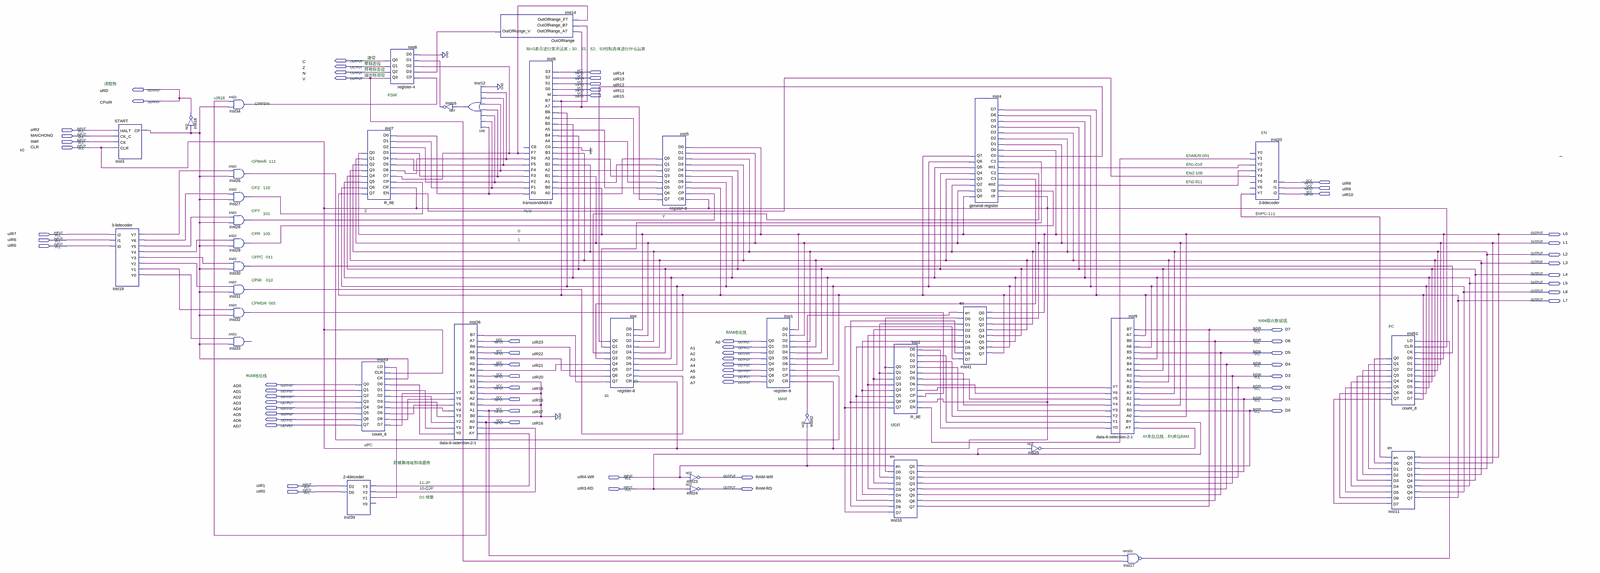
[diagram p0: schematic sheet, whole]
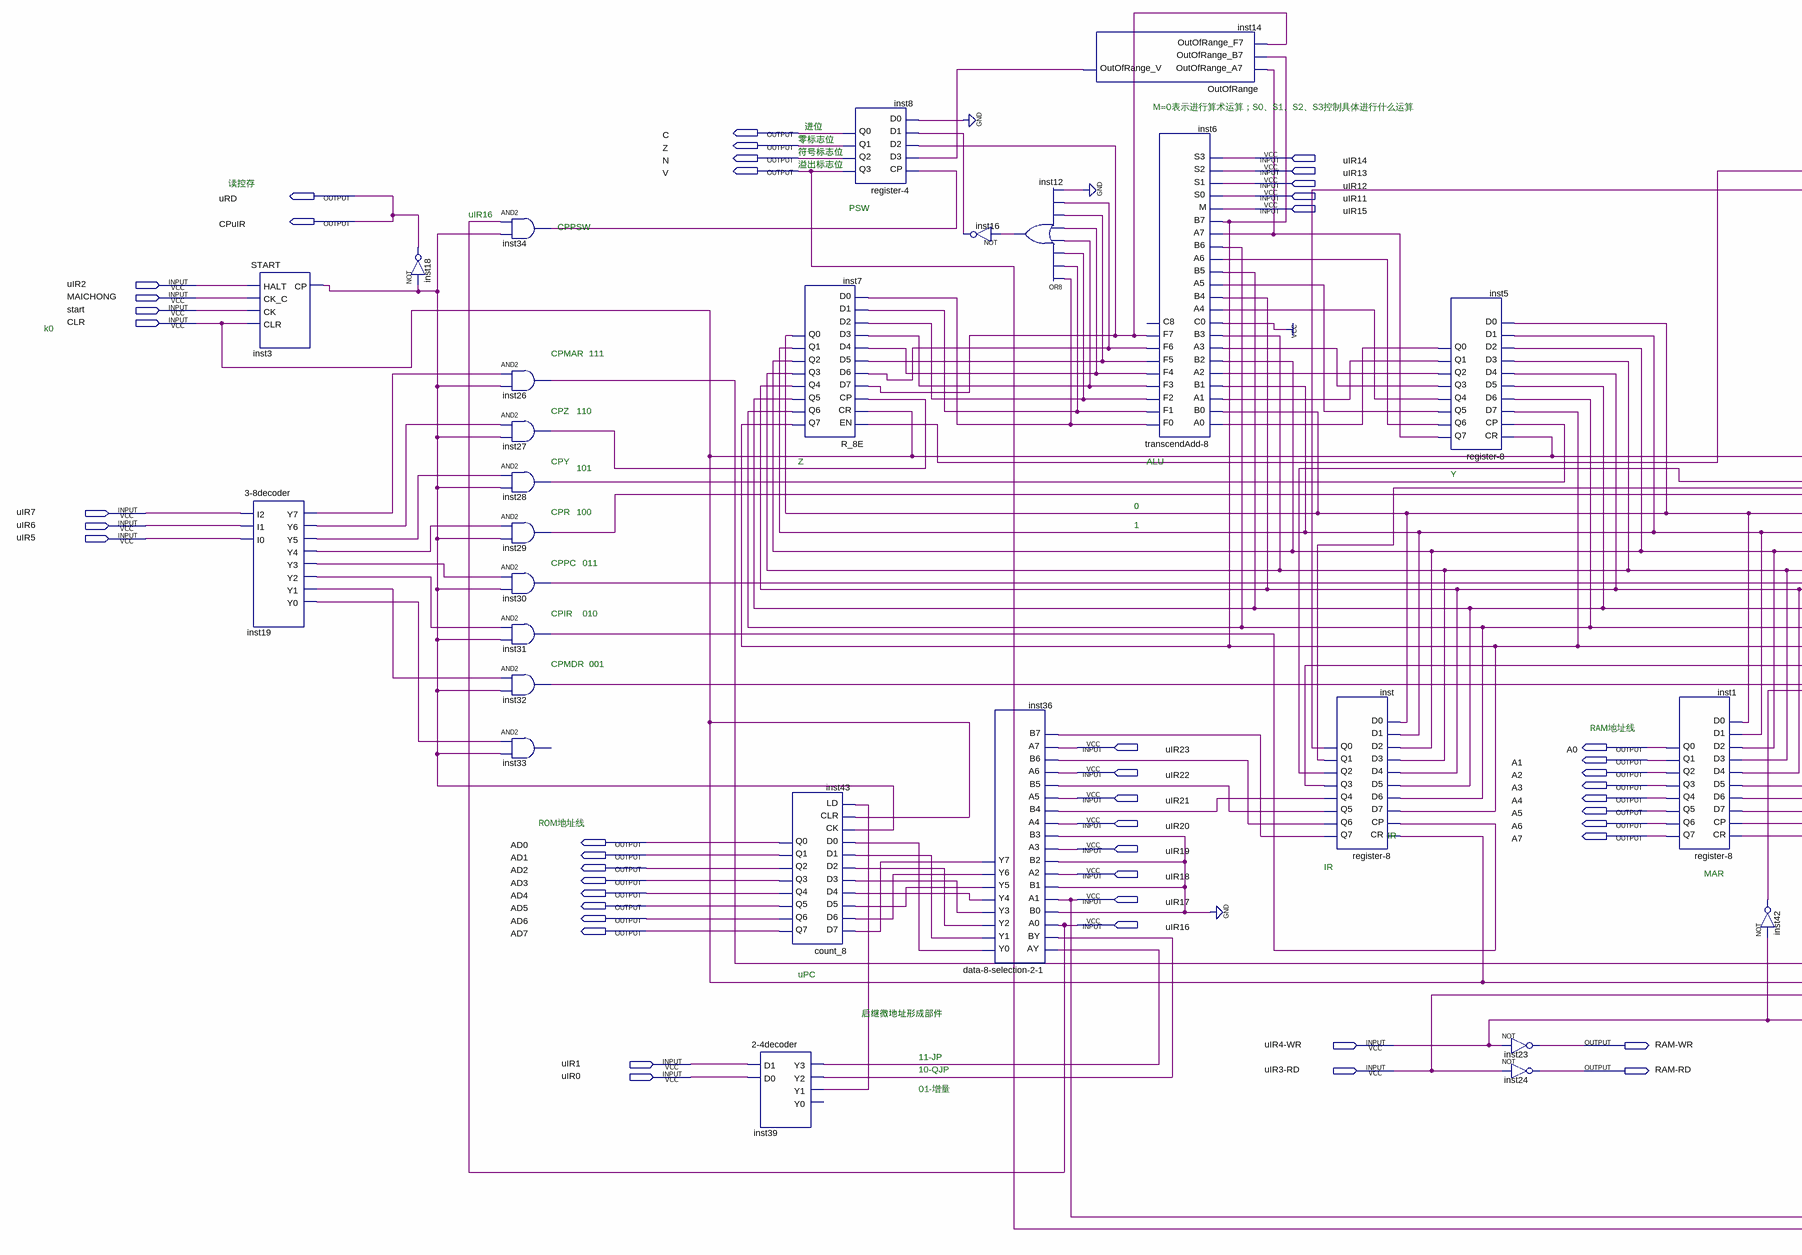
[diagram p1: schematic sheet, left part]
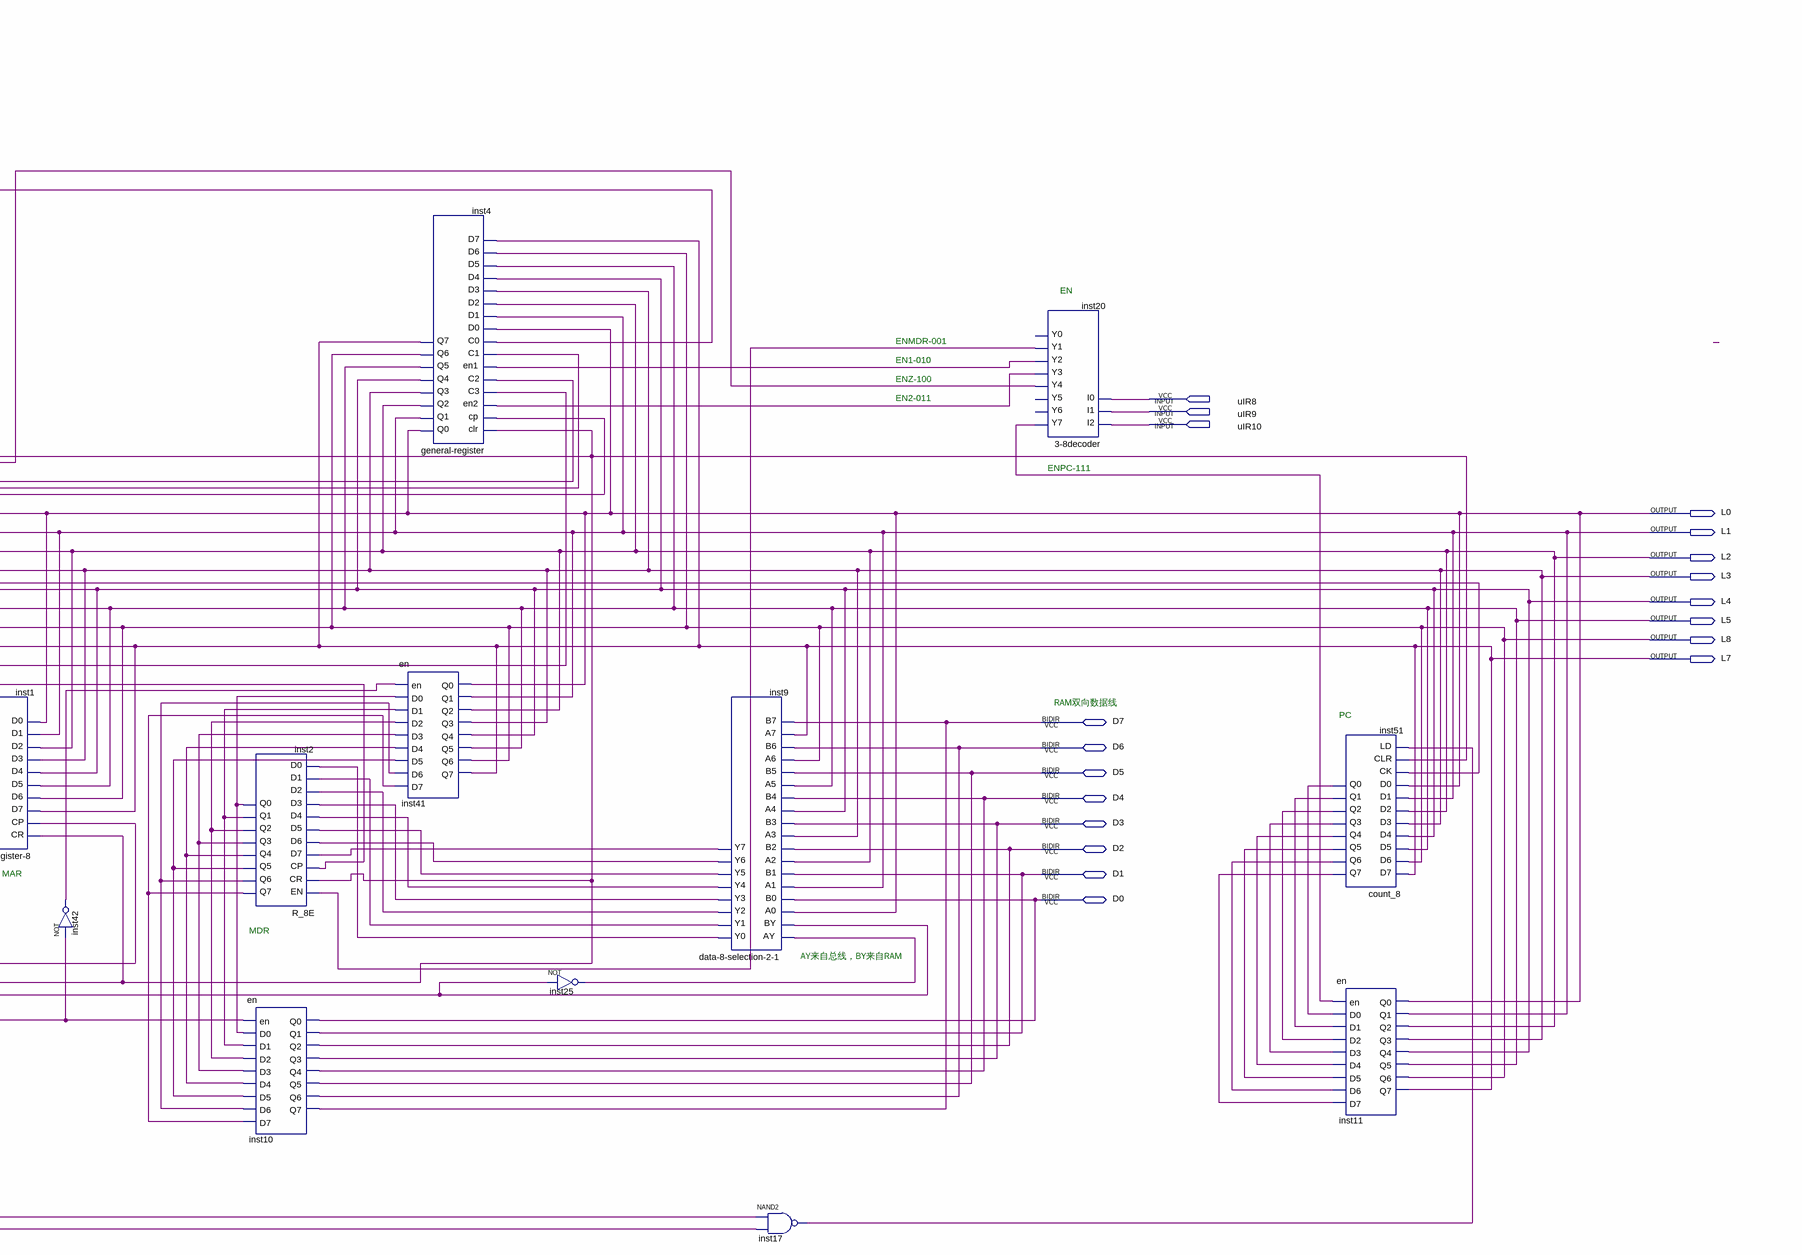
[diagram p2: schematic sheet, right part]
// Quartus schematic overallMachine_2.bdf as structural Verilog: 37 symbols, 67 pins
module overallMachine_2 (
  input  uIR14,
  input  uIR13,
  input  uIR12,
  input  uIR11,
  input  uIR15,
  input  uIR2,
  input  MAICHONG,
  input  start,
  input  CLR,
  input  uIR8,
  input  uIR9,
  input  uIR10,
  input  uIR7,
  input  uIR6,
  input  uIR5,
  input  uIR23,
  input  uIR22,
  input  uIR21,
  input  uIR20,
  input  uIR19,
  input  uIR18,
  input  uIR17,
  input  uIR16,
  input  \uIR4-WR ,
  input  uIR1,
  input  \uIR3-RD ,
  input  uIR0,
  inout  D7,
  inout  D6,
  inout  D5,
  inout  D4,
  inout  D3,
  inout  D2,
  inout  D1,
  inout  D0,
  output C,
  output Z,
  output N,
  output V,
  output uRD,
  output CPuIR,
  output L0,
  output L1,
  output L2,
  output L3,
  output L4,
  output L5,
  output L8,
  output L7,
  output A0,
  output A1,
  output A2,
  output A3,
  output A4,
  output A5,
  output A6,
  output A7,
  output AD0,
  output AD1,
  output AD2,
  output AD3,
  output AD4,
  output AD5,
  output AD6,
  output AD7,
  output \RAM-WR ,
  output \RAM-RD 
);

  wire inst2_q0, inst2_q1, inst2_q2, inst2_q3, inst2_q4, inst2_q5, inst2_q6, inst2_q7, inst3_cp, inst5_q0,
       inst5_q1, inst5_q2, inst5_q3, inst5_q4, inst5_q5, inst5_q6, inst5_q7, inst6_f0, inst6_f1, inst6_f2,
       inst6_f3, inst6_f4, inst6_f5, inst6_f6, inst6_f7, inst9_y0, inst9_y1, inst9_y2, inst9_y3, inst9_y4,
       inst9_y5, inst9_y6, inst9_y7, inst12_out, inst14_outofrange_v, inst16_out, inst17_out, inst19_y0,
       inst19_y1, inst19_y2, inst19_y3, inst19_y4, inst19_y5, inst19_y6, inst19_y7, inst20_y1, inst20_y2,
       inst20_y3, inst20_y4, inst20_y7, inst25_out, inst26_out, inst27_out, inst28_out, inst29_out,
       inst30_out, inst31_out, inst32_out, inst34_out, inst36_y0, inst36_y1, inst36_y2, inst36_y3, inst36_y4,
       inst36_y5, inst36_y6, inst36_y7, inst39_y1, inst39_y2, inst39_y3, inst42_out, inst51_q0, inst51_q1,
       inst51_q2, inst51_q3, inst51_q4, inst51_q5, inst51_q6, inst51_q7, inst_q0, inst_q1, inst_q2, inst_q3,
       inst_q4, inst_q5, inst_q6, inst_q7;

  START inst3 (.HALT(uIR2), .CK_C(MAICHONG), .CK(start), .CLR(CLR), .CP(inst3_cp));
  \3-8decoder  inst19 (
    .I2(uIR7), .I1(uIR6), .I0(uIR5), .Y7(inst19_y7), .Y6(inst19_y6), .Y5(inst19_y5), .Y4(inst19_y4),
    .Y3(inst19_y3), .Y2(inst19_y2), .Y1(inst19_y1), .Y0(inst19_y0));
  not inst18 (CPuIR, inst3_cp);
  and inst34 (inst34_out, uIR16, inst3_cp);
  and inst26 (inst26_out, inst19_y7, inst3_cp);
  and inst27 (inst27_out, inst19_y6, inst3_cp);
  and inst28 (inst28_out, inst19_y5, inst3_cp);
  and inst29 (inst29_out, inst19_y4, inst3_cp);
  and inst30 (inst30_out, inst19_y3, inst3_cp);
  and inst31 (inst31_out, inst19_y2, inst3_cp);
  and inst32 (inst32_out, inst19_y1, inst3_cp);
  // AND2 inst33 has open pins: IN1=inst19_y0, IN2=inst3_cp, OUT=open
  R_8E inst7 (
    .EN(inst20_y4), .CR(CLR), .CP(inst27_out), .D7(inst6_f7), .D6(inst6_f6), .D5(inst6_f5), .D4(inst6_f4),
    .D3(inst6_f3), .D2(inst6_f2), .D1(inst6_f1), .D0(inst6_f0), .Q7(L7), .Q6(L8), .Q5(L5), .Q4(L4), .Q3(L3),
    .Q2(L2), .Q1(L1), .Q0(L0));
  count_8 inst43 (
    .D7(inst36_y7), .D6(inst36_y6), .D5(inst36_y5), .D4(inst36_y4), .D3(inst36_y3), .D2(inst36_y2),
    .D1(inst36_y1), .D0(inst36_y0), .CK(inst3_cp), .CLR(CLR), .LD(inst39_y1), .Q7(AD7), .Q6(AD6), .Q5(AD5),
    .Q4(AD4), .Q3(AD3), .Q2(AD2), .Q1(AD1), .Q0(AD0));
  \2-4decoder  inst39 (.D1(uIR1), .D0(uIR0), .Y3(inst39_y3), .Y2(inst39_y2), .Y1(inst39_y1));  // open: Y0
  \register-4  inst8 (
    .CP(inst34_out), .D3(inst14_outofrange_v), .D2(inst6_f7), .D1(inst16_out), .D0(1'b0), .Q3(V), .Q2(N),
    .Q1(Z), .Q0(C));
  not inst16 (inst16_out, inst12_out);
  \data-8-selection-2-1  inst36 (
    .AY(inst39_y3), .BY(inst39_y2), .A0(uIR16), .B0(1'b0), .A1(uIR17), .B1(1'b0), .A2(uIR18), .B2(1'b0),
    .A3(uIR19), .B3(1'b0), .A4(uIR20), .B4(inst_q4), .A5(uIR21), .B5(inst_q5), .A6(uIR22), .B6(inst_q6),
    .A7(uIR23), .B7(inst_q7), .Y0(inst36_y0), .Y1(inst36_y1), .Y2(inst36_y2), .Y3(inst36_y3), .Y4(inst36_y4),
    .Y5(inst36_y5), .Y6(inst36_y6), .Y7(inst36_y7));
  or inst12 (inst12_out, inst6_f0, inst6_f1, inst6_f2, inst6_f3, inst6_f4, inst6_f5, inst6_f6, 1'b0);
  OutOfRange inst14 (
    .OutOfRange_A7(inst5_q7), .OutOfRange_B7(L7), .OutOfRange_F7(inst6_f7), .OutOfRange_V(inst14_outofrange_v));
  \transcendAdd-8  inst6 (
    .A0(inst5_q0), .B0(L0), .A1(inst5_q1), .B1(L1), .A2(inst5_q2), .B2(L2), .A3(inst5_q3), .B3(L3),
    .C0(1'b1), .A4(inst5_q4), .B4(L4), .A5(inst5_q5), .B5(L5), .A6(inst5_q6), .B6(L8), .A7(inst5_q7),
    .B7(L7), .M(uIR15), .S0(uIR11), .S1(uIR12), .S2(uIR13), .S3(uIR14), .F0(inst6_f0), .F1(inst6_f1),
    .F2(inst6_f2), .F3(inst6_f3), .F4(inst6_f4), .F5(inst6_f5), .F6(inst6_f6), .F7(inst6_f7));  // open: C8
  \register-8  inst (
    .CR(CLR), .CP(inst31_out), .D7(L7), .D6(L8), .D5(L5), .D4(L4), .D3(L3), .D2(L2), .D1(L1), .D0(L0),
    .Q7(inst_q7), .Q6(inst_q6), .Q5(inst_q5), .Q4(inst_q4), .Q3(inst_q3), .Q2(inst_q2), .Q1(inst_q1),
    .Q0(inst_q0));
  \register-8  inst5 (
    .CR(CLR), .CP(inst28_out), .D7(L7), .D6(L8), .D5(L5), .D4(L4), .D3(L3), .D2(L2), .D1(L1), .D0(L0),
    .Q7(inst5_q7), .Q6(inst5_q6), .Q5(inst5_q5), .Q4(inst5_q4), .Q3(inst5_q3), .Q2(inst5_q2), .Q1(inst5_q1),
    .Q0(inst5_q0));
  not inst23 (\RAM-WR , \uIR4-WR );
  not inst24 (\RAM-RD , \uIR3-RD );
  \register-8  inst1 (
    .CR(CLR), .CP(inst26_out), .D7(L7), .D6(L8), .D5(L5), .D4(L4), .D3(L3), .D2(L2), .D1(L1), .D0(L0),
    .Q7(A7), .Q6(A6), .Q5(A5), .Q4(A4), .Q3(A3), .Q2(A2), .Q1(A1), .Q0(A0));
  not inst42 (inst42_out, \uIR4-WR );
  R_8E inst2 (
    .EN(inst20_y1), .CR(CLR), .CP(inst32_out), .D7(inst9_y7), .D6(inst9_y6), .D5(inst9_y5), .D4(inst9_y4),
    .D3(inst9_y3), .D2(inst9_y2), .D1(inst9_y1), .D0(inst9_y0), .Q7(inst2_q7), .Q6(inst2_q6), .Q5(inst2_q5),
    .Q4(inst2_q4), .Q3(inst2_q3), .Q2(inst2_q2), .Q1(inst2_q1), .Q0(inst2_q0));
  en inst10 (
    .en(\uIR4-WR ), .D0(inst2_q0), .D1(inst2_q1), .D2(inst2_q2), .D3(inst2_q3), .D4(inst2_q4), .D5(inst2_q5),
    .D6(inst2_q6), .D7(inst2_q7), .Q0(D0), .Q1(D1), .Q2(D2), .Q3(D3), .Q4(D4), .Q5(D5), .Q6(D6), .Q7(D7));
  en inst41 (
    .en(inst42_out), .D0(inst2_q0), .D1(inst2_q1), .D2(inst2_q2), .D3(inst2_q3), .D4(inst2_q4),
    .D5(inst2_q5), .D6(inst2_q6), .D7(inst2_q7), .Q0(L0), .Q1(L1), .Q2(L2), .Q3(L3), .Q4(L4), .Q5(L5),
    .Q6(L8), .Q7(L7));
  \general-register  inst4 (
    .clr(CLR), .cp(inst29_out), .en2(inst20_y3), .C3(inst_q3), .C2(inst_q2), .en1(inst20_y2), .C1(inst_q1),
    .C0(inst_q0), .D0(L0), .D1(L1), .D2(L2), .D3(L3), .D4(L4), .D5(L5), .D6(L8), .D7(L7), .Q0(L0), .Q1(L1),
    .Q2(L2), .Q3(L3), .Q4(L4), .Q5(L5), .Q6(L8), .Q7(L7));
  not inst25 (inst25_out, \uIR3-RD );
  \data-8-selection-2-1  inst9 (
    .AY(inst25_out), .BY(\uIR3-RD ), .A0(L0), .B0(D0), .A1(L1), .B1(D1), .A2(L2), .B2(D2), .A3(L3), .B3(D3),
    .A4(L4), .B4(D4), .A5(L5), .B5(D5), .A6(L8), .B6(D6), .A7(L7), .B7(D7), .Y0(inst9_y0), .Y1(inst9_y1),
    .Y2(inst9_y2), .Y3(inst9_y3), .Y4(inst9_y4), .Y5(inst9_y5), .Y6(inst9_y6), .Y7(inst9_y7));
  nand inst17 (inst17_out, uIR17, V);
  \3-8decoder  inst20 (
    .I2(uIR10), .I1(uIR9), .I0(uIR8), .Y7(inst20_y7), .Y4(inst20_y4), .Y3(inst20_y3), .Y2(inst20_y2),
    .Y1(inst20_y1));  // open: Y6, Y5, Y0
  count_8 inst51 (
    .D7(L7), .D6(L8), .D5(L5), .D4(L4), .D3(L3), .D2(L2), .D1(L1), .D0(L0), .CK(inst30_out), .CLR(CLR),
    .LD(inst17_out), .Q7(inst51_q7), .Q6(inst51_q6), .Q5(inst51_q5), .Q4(inst51_q4), .Q3(inst51_q3),
    .Q2(inst51_q2), .Q1(inst51_q1), .Q0(inst51_q0));
  en inst11 (
    .en(inst20_y7), .D0(inst51_q0), .D1(inst51_q1), .D2(inst51_q2), .D3(inst51_q3), .D4(inst51_q4),
    .D5(inst51_q5), .D6(inst51_q6), .D7(inst51_q7), .Q0(L0), .Q1(L1), .Q2(L2), .Q3(L3), .Q4(L4), .Q5(L5),
    .Q6(L8), .Q7(L7));

  assign uRD = CPuIR;

  // Notes on the sheet:
  //   M=0表示进行算术运算；S0、S1、S2、S3控制具体进行什么运算
  //   进位
  //   零标志位
  //   符号标志位
  //   溢出标志位
  //   读控存
  //   PSW
  //   uIR16
  //   CPPSW
  //   EN
  //   k0
  //   ENMDR-001
  //   CPMAR
  //   111
  //   EN1-010
  //   ENZ-100
  //   EN2-011
  //   CPZ
  //   110
  //   CPY
  //   Z
  //   ALU
  //   101
  //   ENPC-111
  //   Y
  //   0
  //   CPR
  //   100
  //   1
  //   CPPC
  //   011
  //   CPIR
  //   010
  //   CPMDR
  //   001
  //   RAM双向数据线
  //   PC
  //   RAM地址线
  //   ROM地址线
  //   IR
  //   IR
  //   MAR
  //   MDR
  //   AY来自总线，BY来自RAM
  //   uPC
  //   后继微地址形成部件
  //   11-JP
  //   10-QJP
  //   01-增量
endmodule
